# EAGLE design DrehimpulsAdapter (EAGLE 4.16)
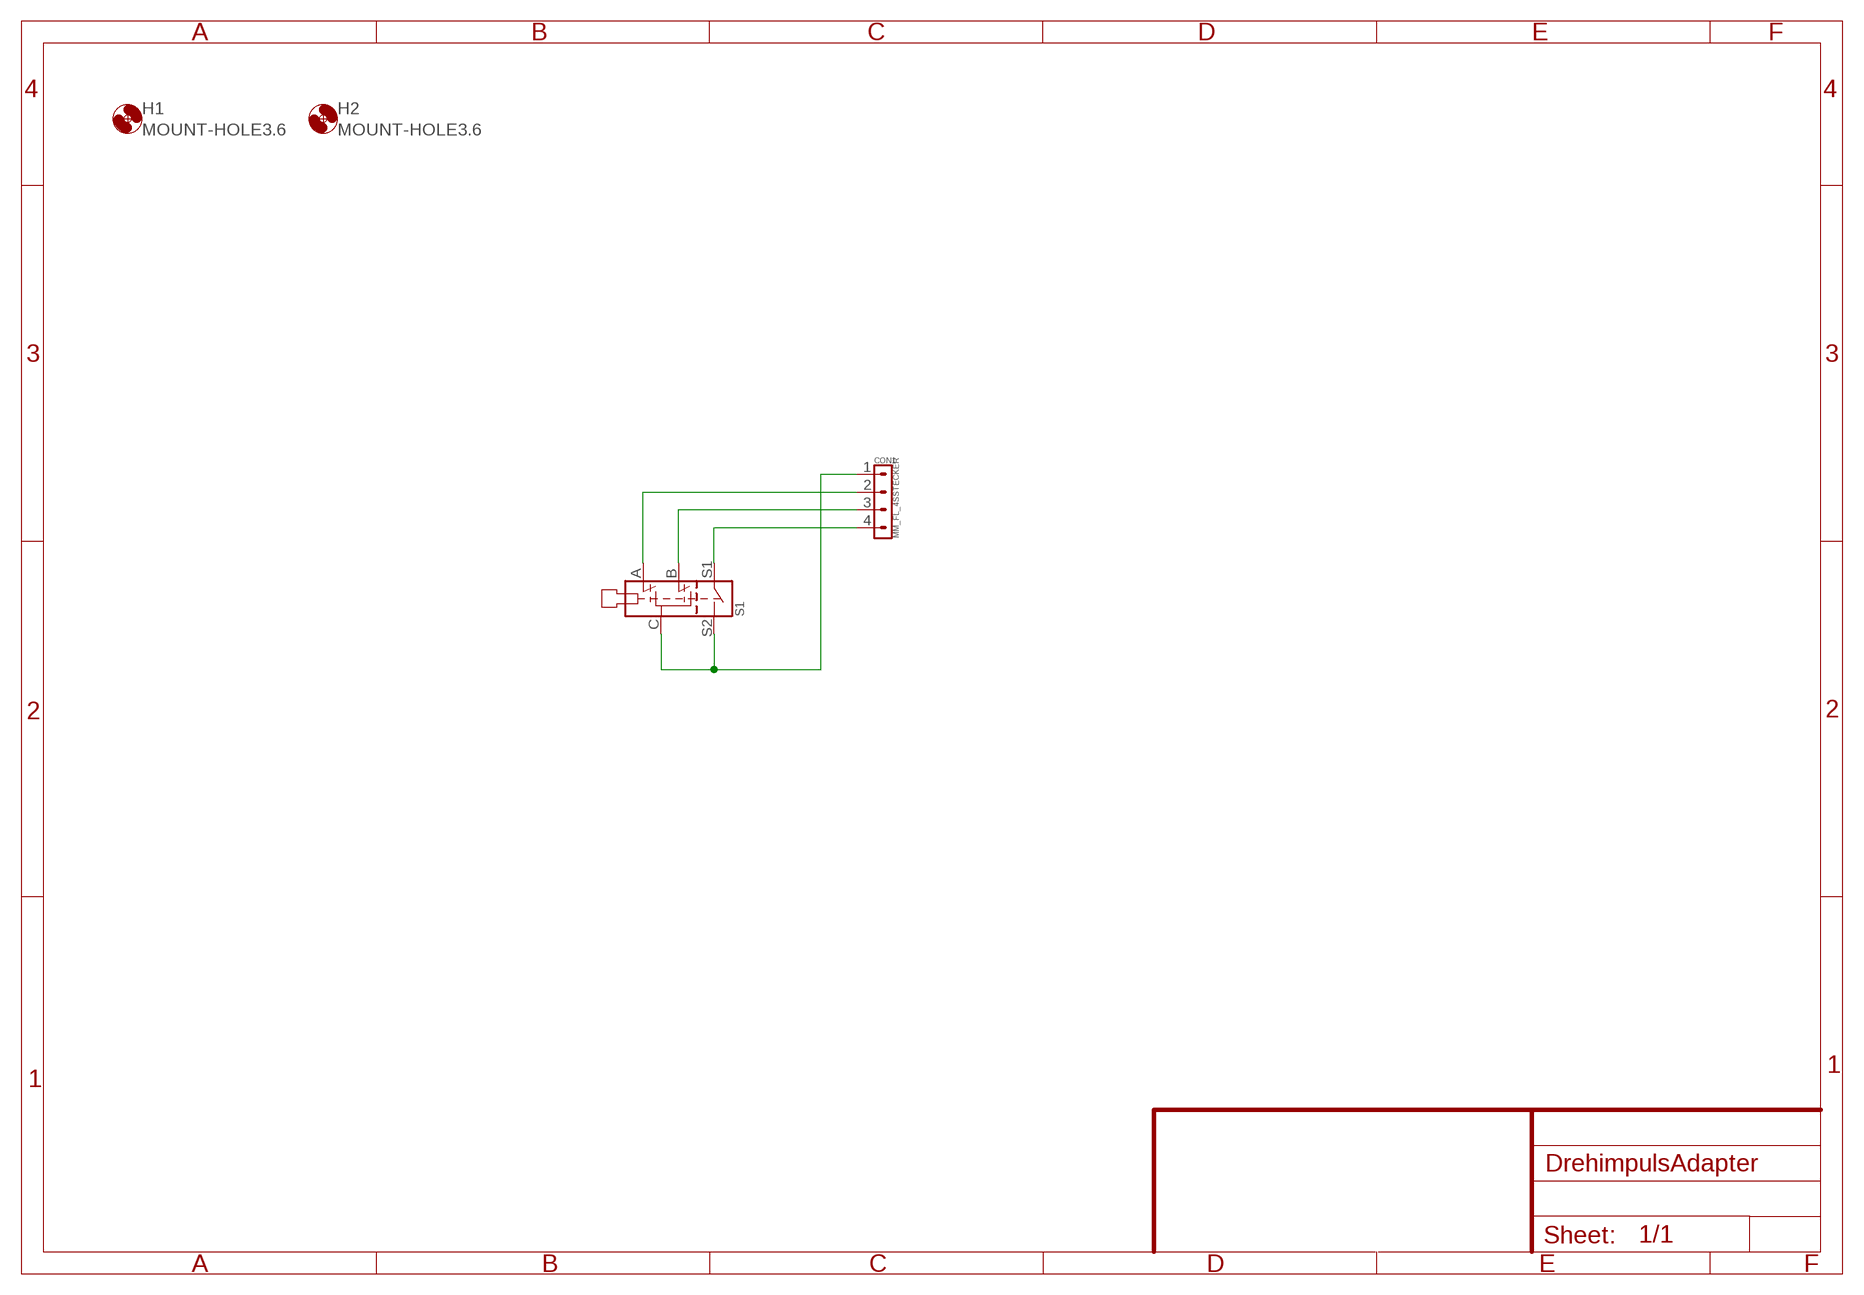
[diagram p0: schematic, sheet 1]

## Parts
CON1  MM_FL_4SSTECKER  [MM_SL_4G]
H1  MOUNT-HOLE3.6  [3,6]
H2  MOUNT-HOLE3.6  [3,6]
S1  DREHIMPULSGEBER_ALPS  [DREHIMPULS_ALPS_VS]

## Nets
N$1: CON1.1 S1.C S1.S2
N$2: CON1.2 S1.A
N$3: CON1.3 S1.B
N$4: CON1.4 S1.S1

## Library data of the parts
CON1 = marcus:MM_FL_4S: Miniatru Print Stecker SMD 4 Kontakte Reichelt Bestellnummer: MM FL 4S Created by Marcus Knips 4/2013
H1 H2 = holes:MOUNT-HOLE: MOUNTING HOLE with drill center marker
S1 = marcus:DREHIMPULSGEBER_ALPS: Drehimpulsgeber Vertikal mit Taster Reichelt Bestellnummer: STEC12E08 Created by Marcus Knips 9/2014

## Board
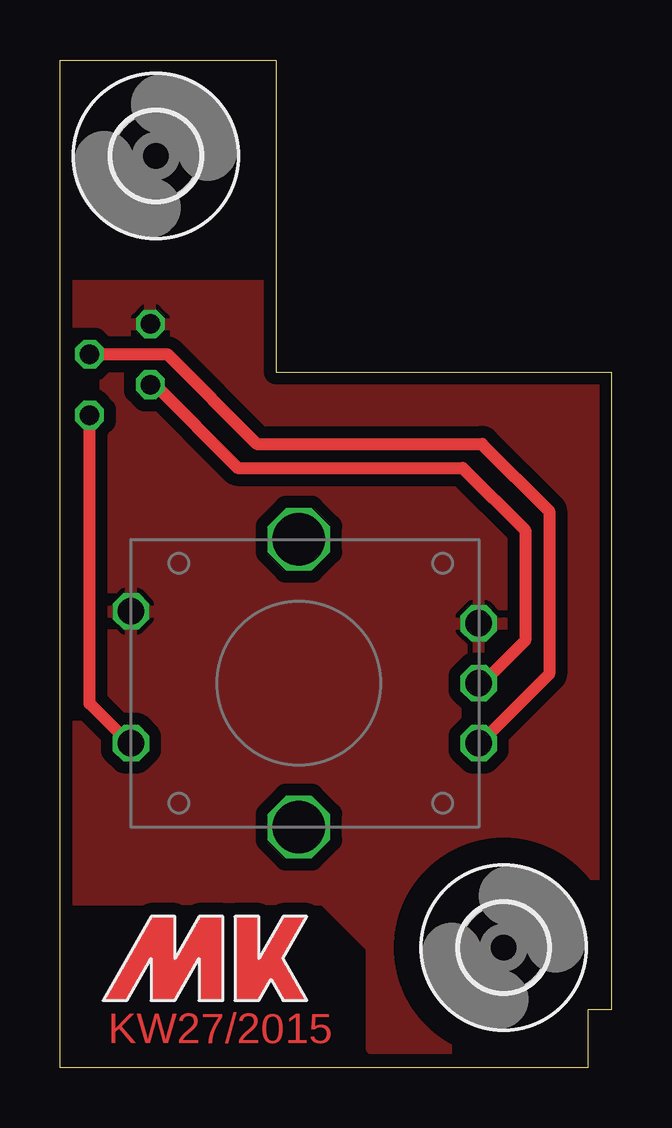
[diagram p1: board, top side]
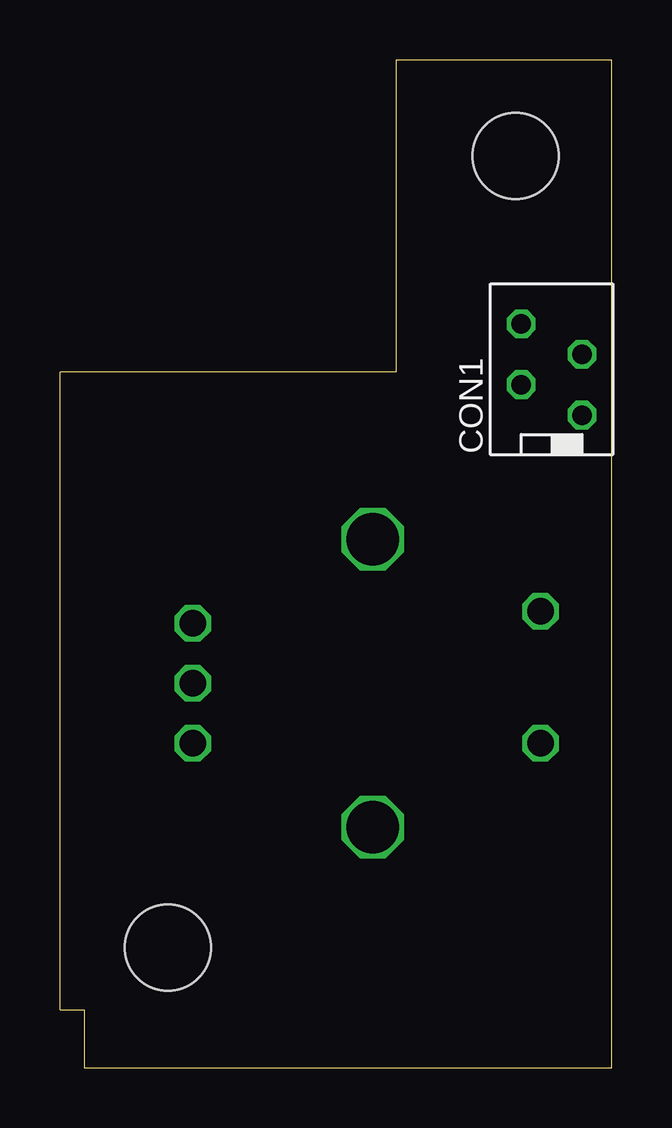
[diagram p2: board, bottom side, seen from below]

Size 23 x 42 mm. Coordinates in mm from the lower left corner, seen from the top.
Outline: 0,0 0,42 9,42 9,29 23,29 23,2.4 22,2.4 22,0 0,0
Copper layers (1*16): Top 0.035mm / dielectric 1.5mm / Bottom 0.035mm
Design rules "multi-cb_035um-cu": minimum track width 6mil, minimum drill 12mil, track to track 6mil, track to pad 6mil, pad to pad 6mil, via to via 6mil, smd to smd 6mil, copper to edge 20mil, drill to drill 8mil, minimum pad ring 8mil, minimum via ring 6mil, stop-mask expansion 3mil, vias tented up to drill 0mil, thermal gap 8mil

### Footprints (pad centres in the part's own frame; a part is rotated, then mirrored left to right if it is on the bottom)
MM_SL_4G = drill 0.8 octagon: 1 0,1.27; 2 -1.27,-1.27; 3 -2.54,1.27; 4 -3.81,-1.27
3,6 = hole 3.6: 0,0
DREHIMPULS_ALPS_VS = drill 1.1 octagon: A -2.5,-7.5; B 0,-7.5; C 2.5,-7.5; S1 -2.5,7; S2 3,7 | drill 2.2 octagon: MOUNT1 -6,0; MOUNT2 6,0

### Placement (x,y rotation side)
CON1  2.5,31 90 bottom
H1  4,38 0 top
H2  18.5,5 0 top
S1  9.96,16.02 90 top
U$1  [LOGO2]  4.8,2.8 0 top

### Tracks (layer width: path | path; a pad name or v marks a point on that pad's centre or on a via)
N$1
  pour Top (isolate 0.5): 0.6,32.6 8.4,32.6 8.4,28.6 22.6,28.6 22.6,3.2 21.4,3.2 21.4,0.8 13,0.8 13,5 11,7 0.6,7
N$2
  Top 0.5: CON1.2 4.47,29.73 8.2,26 17.6,26 20.4,23.2 20.4,16.4 17.52,13.52 S1.A
N$3
  Top 0.5: CON1.3 3.94,28.46 7.4,25 16.8,25 19.4,22.4 19.4,17.8 17.6,16 17.58,16.02 S1.B
N$4
  Top 0.5: 2.96,13.44 3,13.4 | S1.S1 2.96,13.44 | CON1.4 1.23,15.17 2.96,13.44

### Text on the board
Top: KW27/2015